# Altium schematic sheet PLD_Local-Supply.SchDoc: Local Supply
size A4; ApprovedBy: Piotr Kuligowski; CheckedBy: Piotr Kuligowski; Author: Michał Gumiela; SheetNumber: 5; SheetTotal: 13
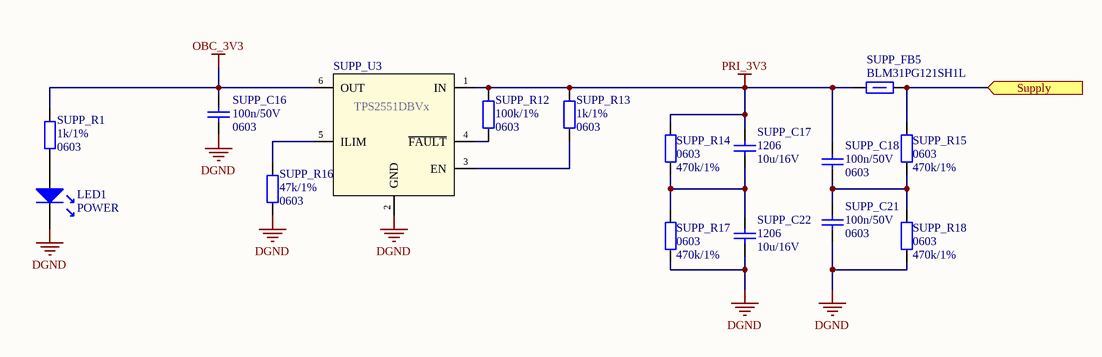
[diagram p0: PLD_Local-Supply.SchDoc]

## Parts
LED1  POWER  [SMD_LED_1206]
SUPP_C16  Package: 0603  [SMD_Capacitor_0603]  (hidden comment: 100n/50V)
SUPP_C17  Packge: 1206  [SMD_Capacitor_1206]  (hidden comment: 10u/16V)
SUPP_C18  Package: 0603  [SMD_Capacitor_0603]  (hidden comment: 100n/50V)
SUPP_C21  Package: 0603  [SMD_Capacitor_0603]  (hidden comment: 100n/50V)
SUPP_C22  Packge: 1206  [SMD_Capacitor_1206]  (hidden comment: 10u/16V)
SUPP_FB5  120R/100MHz  [SMD_FerriteBead_1206]  (value not drawn)
SUPP_R1  Package: 0603  [SMD_Resistor_0603]  (hidden comment: 1k/1%)
SUPP_R12  Package: 0603  [SMD_Resistor_0603]  (hidden comment: 100k/1%)
SUPP_R13  Package: 0603  [SMD_Resistor_0603]  (hidden comment: 1k/1%)
SUPP_R14  Package: 0603  [SMD_Resistor_0603]  (hidden comment: 470k/1%)
SUPP_R15  Package: 0603  [SMD_Resistor_0603]  (hidden comment: 470k/1%)
SUPP_R16  Package: 0603  [SMD_Resistor_0603]  (hidden comment: 47k/1%)
SUPP_R17  Package: 0603  [SMD_Resistor_0603]  (hidden comment: 470k/1%)
SUPP_R18  Package: 0603  [SMD_Resistor_0603]  (hidden comment: 470k/1%)
SUPP_U3  TPS2551DBVx  [SOT23-6]

## Ports
Supply (in)

## Nets
DGND: LED1.K SUPP_C16.1 SUPP_C21.2 SUPP_C22.2 SUPP_R16.2 SUPP_R17.2 SUPP_R18.2 SUPP_U3.2(GND)
OBC_3V3: SUPP_C16.2 SUPP_R1.1 SUPP_U3.6(OUT)
PRI_3V3: SUPP_C17.1 SUPP_C18.1 SUPP_FB5.2 SUPP_R12.1 SUPP_R13.1 SUPP_R14.1 SUPP_U3.1(IN)
Supply: SUPP_FB5.1 SUPP_R15.1 ; port Supply
NetLED1_A: LED1.A SUPP_R1.2
NetSUPP_C17_2: SUPP_C17.2 SUPP_C22.1 SUPP_R14.2 SUPP_R17.1
NetSUPP_C18_2: SUPP_C18.2 SUPP_C21.1 SUPP_R15.2 SUPP_R18.1
NetSUPP_R12_2: SUPP_R12.2 SUPP_U3.4(~{FAULT})
NetSUPP_R13_2: SUPP_R13.2 SUPP_U3.3(EN)
NetSUPP_R16_1: SUPP_R16.1 SUPP_U3.5(ILIM)

## Notes on the sheet
- Title:
- Project:
- Author:
- Model:
- Document Number:
- Checked by:
- Rev:
- Date:
- Approved by:
- Sheet:
- of
- File name:

## Library data of the parts
LED1 = LED-1206_RED: LED diode, SMD1206 package.; Value: POWER; Supplier 1: Farnell; Farnell: 1581229
SUPP_C16 SUPP_C18 SUPP_C21 = Cer_C0603T104K5RALTU: Ceramic Cap Kemet COTS 100n/50V X7R 0603; Manufacturer: Kemet; ManufacturerPartNumber: C0603T104K5RALTU; Value: 100n/50V
SUPP_C17 SUPP_C22 = Cer_C1206T106K4RACTU: Ceramic Cap Kemet COTS 10u/16V X7R 1206; ManufacturerPartNumber: C1206T106K4RACTU; Manufacturer: Kemet; Value: 10u/16V
SUPP_FB5 = BLM31PG121SH1L: Ferrite bead, 1206, 0.02HM, 3.5A.; Manufacturer: Murata; Current Rating: 3.5A; Series Resistance DC: 0.02R; Package: 1206; Value: 120R/100MHz; ManufacturerPartNumber: BLM31PG121SH1L
SUPP_R1 SUPP_R13 = CRCW06031K00FKxxxx: 1k/1% Vishay CRCW 0603 Resistor. 100mW, 100ppm, 75V.; Manufacturer: Vishay; ManufacturerPartNumber: CRCW06031K00FKxxxx; Value: 1k/1%
SUPP_R12 = CRCW0603100KFKxxxx: 100k/1% Vishay CRCW 0603 Resistor. 100mW, 100ppm, 75V.; Manufacturer: Vishay; ManufacturerPartNumber: CRCW0603100KFKxxxx; Value: 100k/1%
SUPP_R14 SUPP_R15 SUPP_R17 SUPP_R18 = CRCW0603470KFKxxxx: 470k/1% Vishay CRCW 0603 Resistor. 100mW, 100ppm, 75V.; Manufacturer: Vishay; ManufacturerPartNumber: CRCW0603470KFKxxxx; Value: 470k/1%
SUPP_R16 = CRCW060347K0FKxxxx: 47k/1% Vishay CRCW 0603 Resistor. 100mW, 100ppm, 75V.; Manufacturer: Vishay; ManufacturerPartNumber: CRCW060347K0FKxxxx; Value: 47k/1%
SUPP_U3 = TPS2551DBVx: Adjustable Current-Limited Power-Distribution Switch.; Manufacturer: Texas Instruments; Value: TPS2551DBVx